# Altium schematic sheet Skayboard.SchDoc: Skayboard
size 762 x 304 mm; ApprovedBy: NNNI; CheckedBy: NNNI; Author: Skaytacium; CompanyName: Skaytacium Inc.; DrawnBy: Skaytacium; Engineer: SSSI; Organization: Skaytacium Inc.; Revision: 6
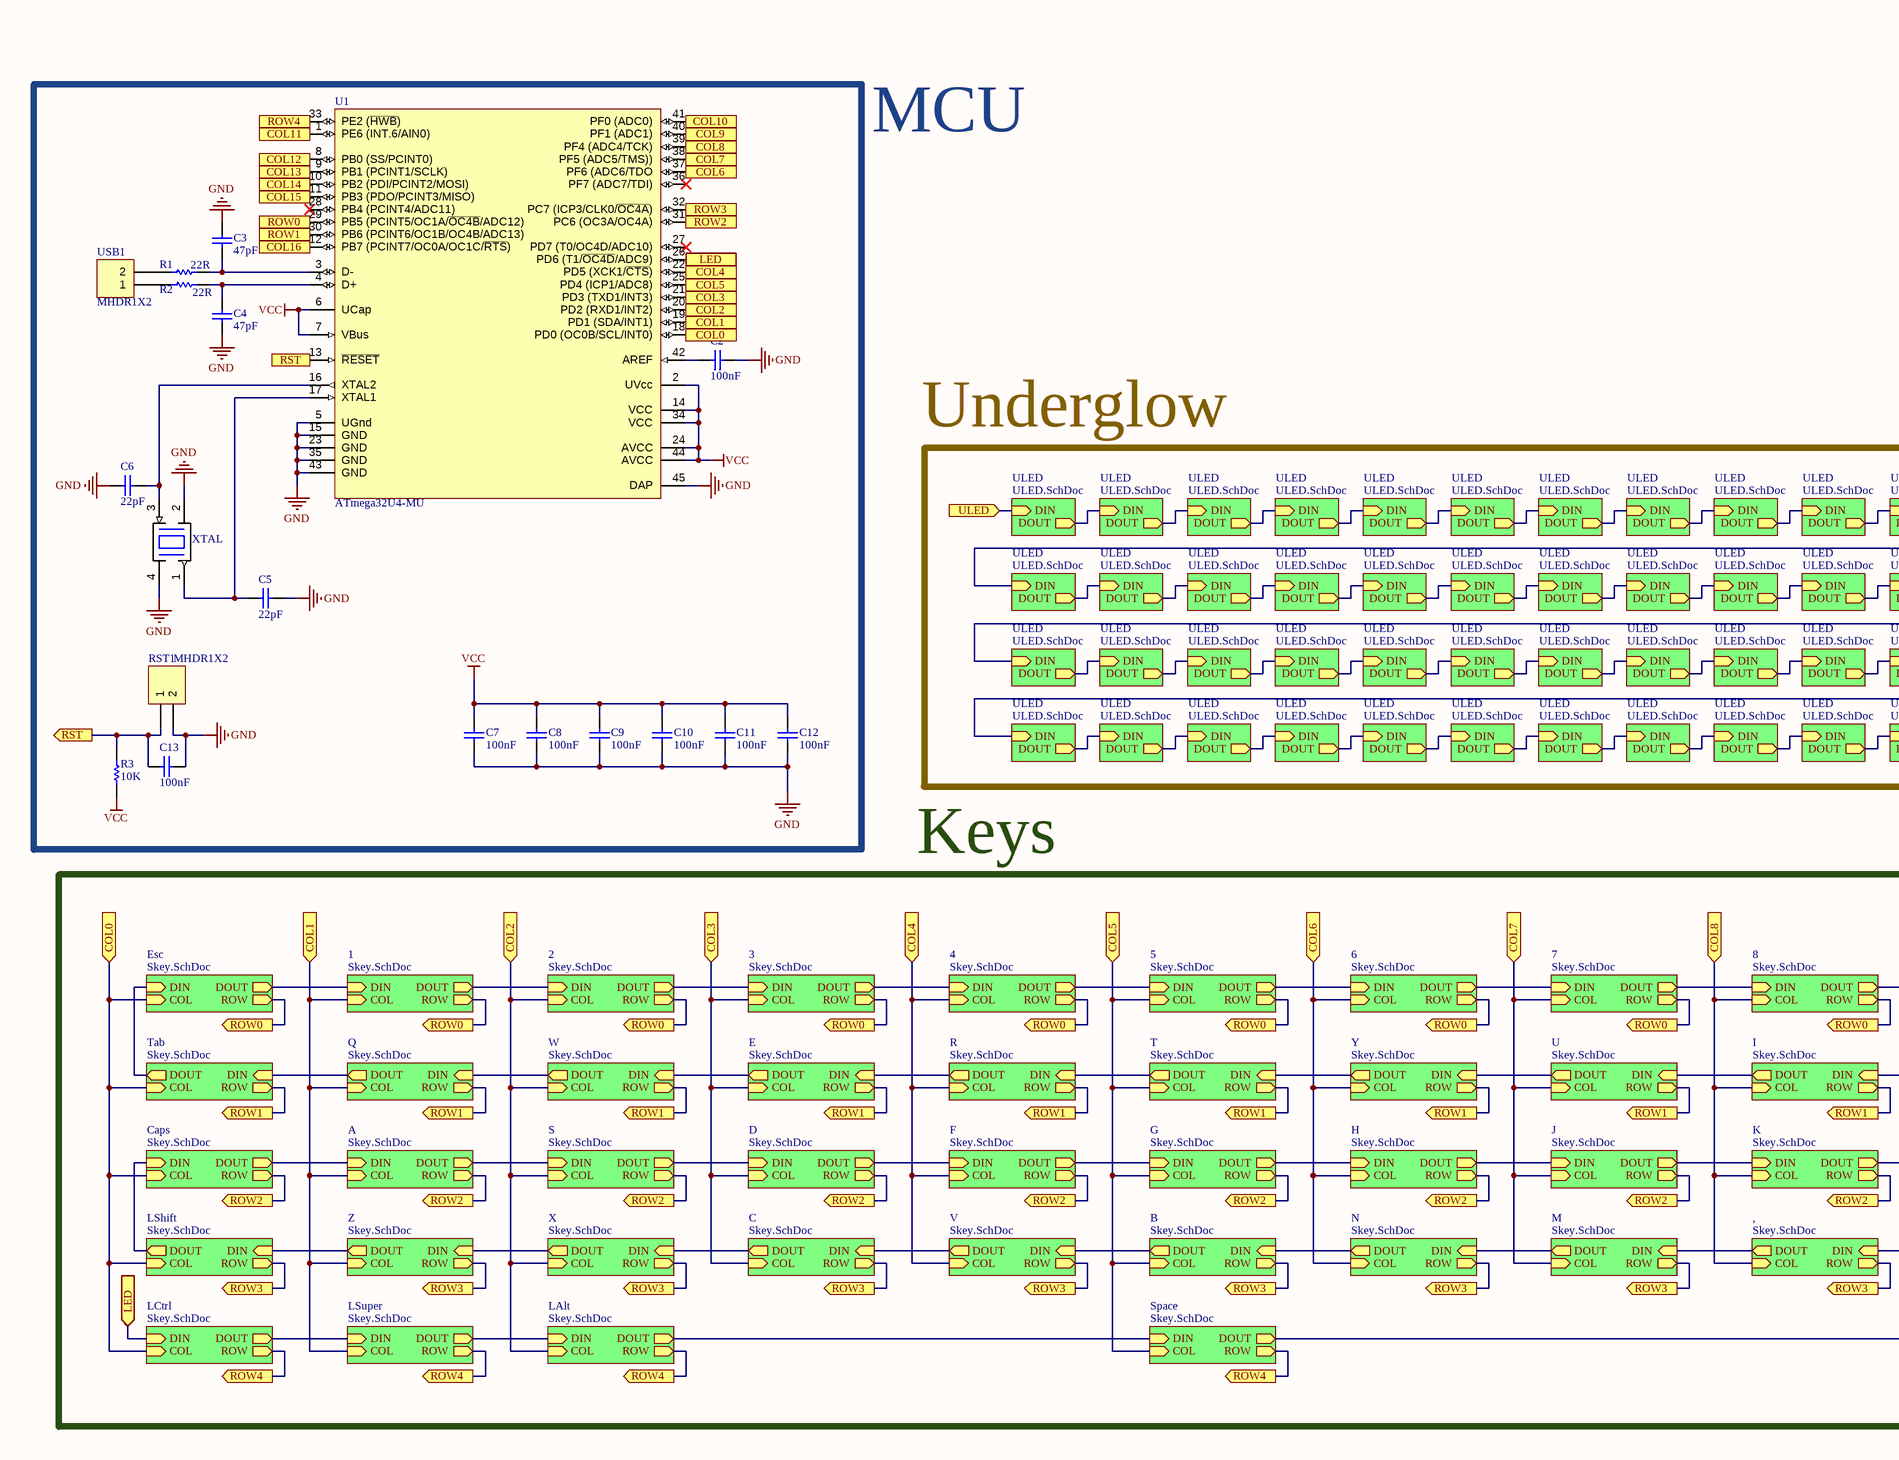
[diagram p0: Skayboard.SchDoc, left]
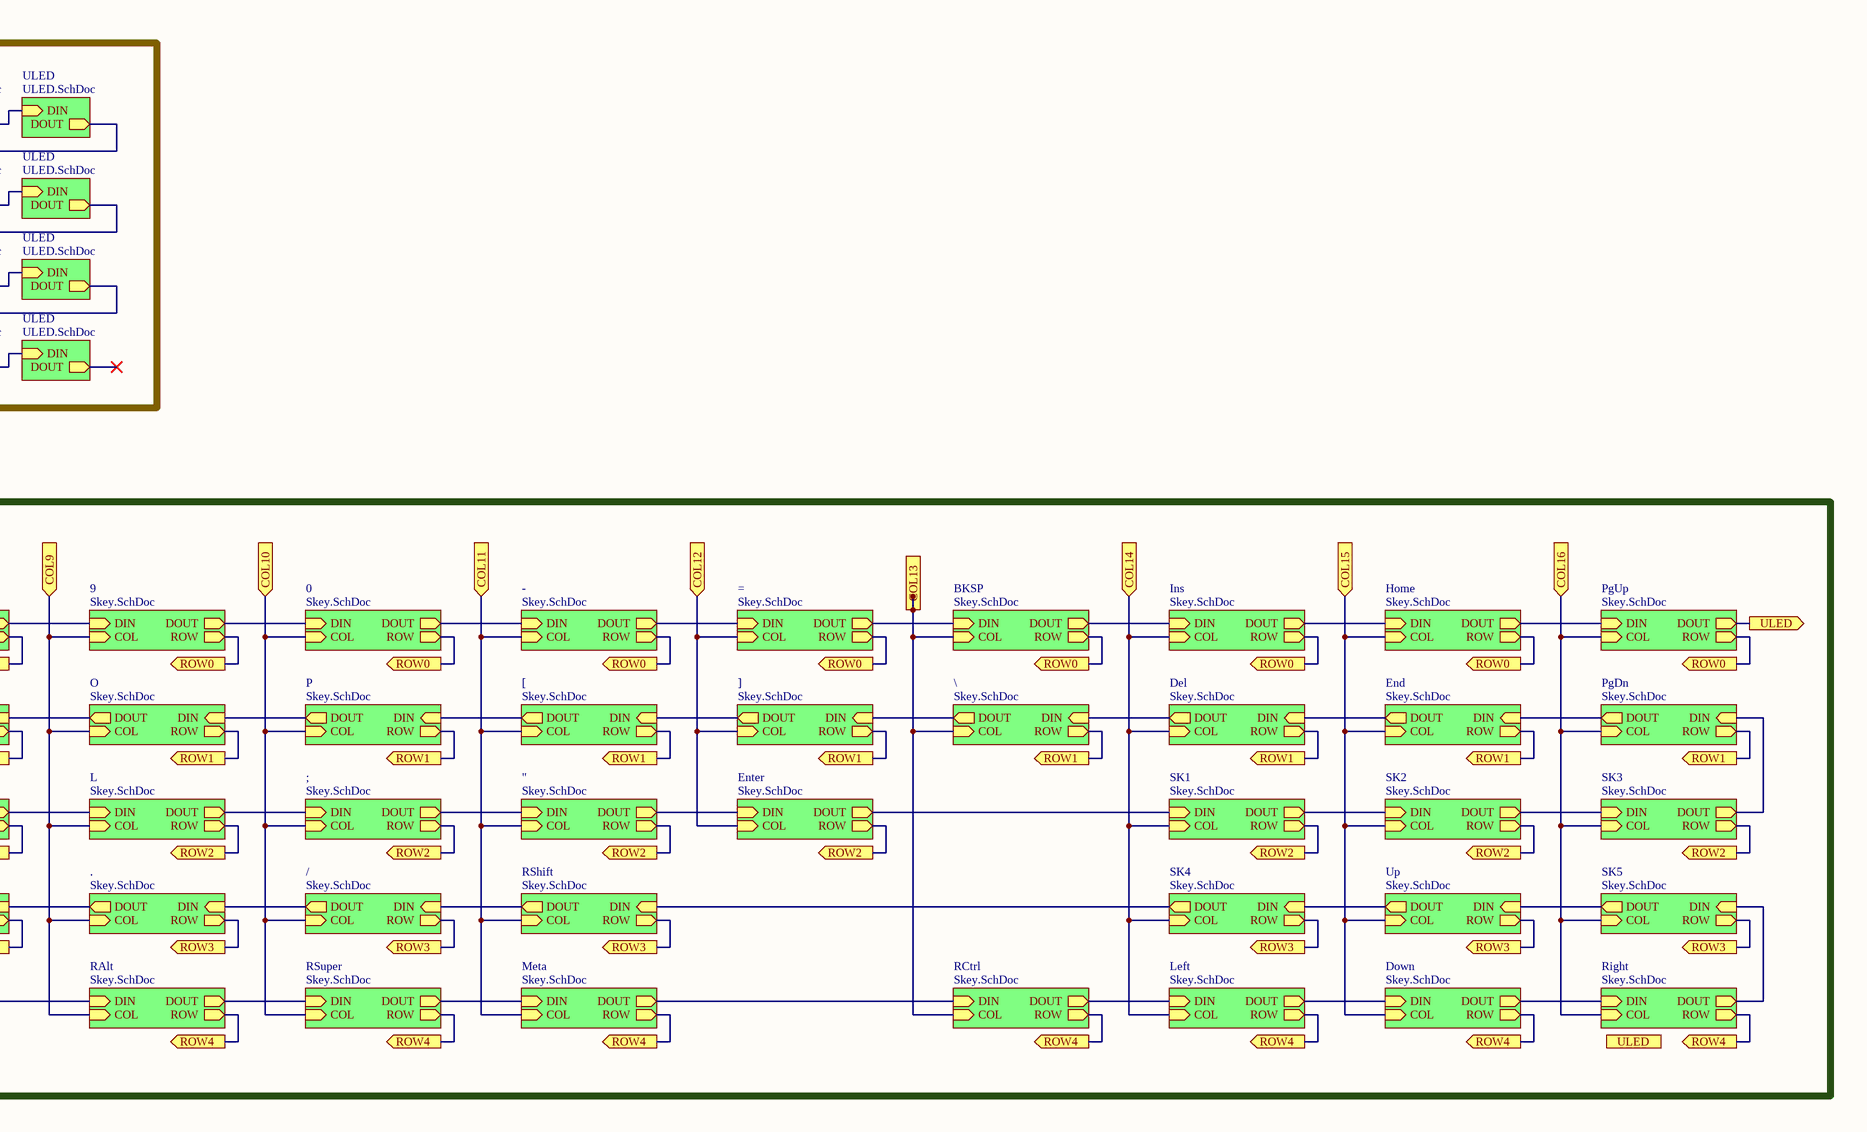
[diagram p1: Skayboard.SchDoc, right]

## Parts
C2  100nF  [CAPC1005X55X30LL05T10]
C3  47pF  [CAPC1005X55X25LL05T10]
C4  47pF  [CAPC1005X55X25LL05T10]
C5  22pF  [CAPC1005X56X25NL10T15]
C6  22pF  [CAPC1005X56X25NL10T15]
C7  100nF  [CAPC1005X55X30LL05T10]
C8  100nF  [CAPC1005X55X30LL05T10]
C9  100nF  [CAPC1005X55X30LL05T10]
C10  100nF  [CAPC1005X55X30LL05T10]
C11  100nF  [CAPC1005X55X30LL05T10]
C12  100nF  [CAPC1005X55X30LL05T10]
C13  100nF  [CAPC1005X55X30LL05T10]
R1  22R  [RESC1005X40X25LL05T05]
R2  22R  [RESC1005X40X25LL05T05]
R3  10K  [RESC1005X40X25NL05T05]
RST1  MHDR1X2  [MHDR1X2]
U1  ATmega32U4-MU  [44PW_M]
USB1  MHDR1X2  [MHDR1X2]
XTAL  16MCR  [XTAL16M]  (value not drawn)

## Sub-sheets
0 = Skey.SchDoc: ROW (out), COL (in), DIN (in), DOUT (out)
1 = Skey.SchDoc: ROW (out), COL (in), DIN (in), DOUT (out)
2 = Skey.SchDoc: ROW (out), COL (in), DIN (in), DOUT (out)
3 = Skey.SchDoc: ROW (out), COL (in), DIN (in), DOUT (out)
4 = Skey.SchDoc: ROW (out), COL (in), DIN (in), DOUT (out)
5 = Skey.SchDoc: ROW (out), COL (in), DIN (in), DOUT (out)
6 = Skey.SchDoc: ROW (out), COL (in), DIN (in), DOUT (out)
7 = Skey.SchDoc: ROW (out), COL (in), DIN (in), DOUT (out)
8 = Skey.SchDoc: ROW (out), COL (in), DIN (in), DOUT (out)
9 = Skey.SchDoc: ROW (out), COL (in), DIN (in), DOUT (out)
" = Skey.SchDoc: ROW (out), COL (in), DIN (in), DOUT (out)
, = Skey.SchDoc: ROW (out), COL (in), DIN (in), DOUT (out)
- = Skey.SchDoc: ROW (out), COL (in), DIN (in), DOUT (out)
. = Skey.SchDoc: ROW (out), COL (in), DIN (in), DOUT (out)
/ = Skey.SchDoc: ROW (out), COL (in), DIN (in), DOUT (out)
; = Skey.SchDoc: ROW (out), COL (in), DIN (in), DOUT (out)
= = Skey.SchDoc: ROW (out), COL (in), DIN (in), DOUT (out)
[ = Skey.SchDoc: ROW (out), COL (in), DIN (in), DOUT (out)
\ = Skey.SchDoc: ROW (out), COL (in), DIN (in), DOUT (out)
] = Skey.SchDoc: ROW (out), COL (in), DIN (in), DOUT (out)
A = Skey.SchDoc: ROW (out), COL (in), DIN (in), DOUT (out)
B = Skey.SchDoc: ROW (out), COL (in), DIN (in), DOUT (out)
BKSP = Skey.SchDoc: ROW (out), COL (in), DIN (in), DOUT (out)
C = Skey.SchDoc: ROW (out), COL (in), DIN (in), DOUT (out)
Caps = Skey.SchDoc: ROW (out), COL (in), DIN (in), DOUT (out)
D = Skey.SchDoc: ROW (out), COL (in), DIN (in), DOUT (out)
Del = Skey.SchDoc: ROW (out), COL (in), DIN (in), DOUT (out)
Down = Skey.SchDoc: ROW (out), COL (in), DIN (in), DOUT (out)
E = Skey.SchDoc: ROW (out), COL (in), DIN (in), DOUT (out)
End = Skey.SchDoc: ROW (out), COL (in), DIN (in), DOUT (out)
Enter = Skey.SchDoc: ROW (out), COL (in), DIN (in), DOUT (out)
Esc = Skey.SchDoc: ROW (out), COL (in), DIN (in), DOUT (out)
F = Skey.SchDoc: ROW (out), COL (in), DIN (in), DOUT (out)
G = Skey.SchDoc: ROW (out), COL (in), DIN (in), DOUT (out)
H = Skey.SchDoc: ROW (out), COL (in), DIN (in), DOUT (out)
Home = Skey.SchDoc: ROW (out), COL (in), DIN (in), DOUT (out)
I = Skey.SchDoc: ROW (out), COL (in), DIN (in), DOUT (out)
Ins = Skey.SchDoc: ROW (out), COL (in), DIN (in), DOUT (out)
J = Skey.SchDoc: ROW (out), COL (in), DIN (in), DOUT (out)
K = Skey.SchDoc: ROW (out), COL (in), DIN (in), DOUT (out)
L = Skey.SchDoc: ROW (out), COL (in), DIN (in), DOUT (out)
LAlt = Skey.SchDoc: ROW (out), COL (in), DIN (in), DOUT (out)
LCtrl = Skey.SchDoc: ROW (out), COL (in), DIN (in), DOUT (out)
Left = Skey.SchDoc: ROW (out), COL (in), DIN (in), DOUT (out)
LShift = Skey.SchDoc: ROW (out), COL (in), DIN (in), DOUT (out)
LSuper = Skey.SchDoc: ROW (out), COL (in), DIN (in), DOUT (out)
M = Skey.SchDoc: ROW (out), COL (in), DIN (in), DOUT (out)
Meta = Skey.SchDoc: ROW (out), COL (in), DIN (in), DOUT (out)
N = Skey.SchDoc: ROW (out), COL (in), DIN (in), DOUT (out)
O = Skey.SchDoc: ROW (out), COL (in), DIN (in), DOUT (out)
P = Skey.SchDoc: ROW (out), COL (in), DIN (in), DOUT (out)
PgDn = Skey.SchDoc: ROW (out), COL (in), DIN (in), DOUT (out)
PgUp = Skey.SchDoc: ROW (out), COL (in), DIN (in), DOUT (out)
Q = Skey.SchDoc: ROW (out), COL (in), DIN (in), DOUT (out)
R = Skey.SchDoc: ROW (out), COL (in), DIN (in), DOUT (out)
RAlt = Skey.SchDoc: ROW (out), COL (in), DIN (in), DOUT (out)
RCtrl = Skey.SchDoc: ROW (out), COL (in), DIN (in), DOUT (out)
Right = Skey.SchDoc: ROW (out), COL (in), DIN (in), DOUT (out)
RShift = Skey.SchDoc: ROW (out), COL (in), DIN (in), DOUT (out)
RSuper = Skey.SchDoc: ROW (out), COL (in), DIN (in), DOUT (out)
S = Skey.SchDoc: ROW (out), COL (in), DIN (in), DOUT (out)
SK1 = Skey.SchDoc: ROW (out), COL (in), DIN (in), DOUT (out)
SK2 = Skey.SchDoc: ROW (out), COL (in), DIN (in), DOUT (out)
SK3 = Skey.SchDoc: ROW (out), COL (in), DIN (in), DOUT (out)
SK4 = Skey.SchDoc: ROW (out), COL (in), DIN (in), DOUT (out)
SK5 = Skey.SchDoc: ROW (out), COL (in), DIN (in), DOUT (out)
Space = Skey.SchDoc: ROW (out), COL (in), DIN (in), DOUT (out)
T = Skey.SchDoc: ROW (out), COL (in), DIN (in), DOUT (out)
Tab = Skey.SchDoc: ROW (out), COL (in), DIN (in), DOUT (out)
U = Skey.SchDoc: ROW (out), COL (in), DIN (in), DOUT (out)
ULED = ULED.SchDoc: DOUT (out), DIN (in)
ULED = ULED.SchDoc: DOUT (out), DIN (in)
ULED = ULED.SchDoc: DOUT (out), DIN (in)
ULED = ULED.SchDoc: DOUT (out), DIN (in)
ULED = ULED.SchDoc: DOUT (out), DIN (in)
ULED = ULED.SchDoc: DOUT (out), DIN (in)
ULED = ULED.SchDoc: DOUT (out), DIN (in)
ULED = ULED.SchDoc: DOUT (out), DIN (in)
ULED = ULED.SchDoc: DOUT (out), DIN (in)
ULED = ULED.SchDoc: DOUT (out), DIN (in)
ULED = ULED.SchDoc: DOUT (out), DIN (in)
ULED = ULED.SchDoc: DOUT (out), DIN (in)
ULED = ULED.SchDoc: DOUT (out), DIN (in)
ULED = ULED.SchDoc: DOUT (out), DIN (in)
ULED = ULED.SchDoc: DOUT (out), DIN (in)
ULED = ULED.SchDoc: DOUT (out), DIN (in)
ULED = ULED.SchDoc: DOUT (out), DIN (in)
ULED = ULED.SchDoc: DOUT (out), DIN (in)
ULED = ULED.SchDoc: DOUT (out), DIN (in)
ULED = ULED.SchDoc: DOUT (out), DIN (in)
ULED = ULED.SchDoc: DOUT (out), DIN (in)
ULED = ULED.SchDoc: DOUT (out), DIN (in)
ULED = ULED.SchDoc: DOUT (out), DIN (in)
ULED = ULED.SchDoc: DOUT (out), DIN (in)
ULED = ULED.SchDoc: DOUT (out), DIN (in)
ULED = ULED.SchDoc: DOUT (out), DIN (in)
ULED = ULED.SchDoc: DOUT (out), DIN (in)
ULED = ULED.SchDoc: DOUT (out), DIN (in)
ULED = ULED.SchDoc: DOUT (out), DIN (in)
ULED = ULED.SchDoc: DOUT (out), DIN (in)
ULED = ULED.SchDoc: DOUT (out), DIN (in)
ULED = ULED.SchDoc: DOUT (out), DIN (in)
ULED = ULED.SchDoc: DOUT (out), DIN (in)
ULED = ULED.SchDoc: DOUT (out), DIN (in)
ULED = ULED.SchDoc: DOUT (out), DIN (in)
ULED = ULED.SchDoc: DOUT (out), DIN (in)
ULED = ULED.SchDoc: DOUT (out), DIN (in)
ULED = ULED.SchDoc: DOUT (out), DIN (in)
ULED = ULED.SchDoc: DOUT (out), DIN (in)
ULED = ULED.SchDoc: DOUT (out), DIN (in)
ULED = ULED.SchDoc: DOUT (out), DIN (in)
ULED = ULED.SchDoc: DOUT (out), DIN (in)
ULED = ULED.SchDoc: DOUT (out), DIN (in)
ULED = ULED.SchDoc: DOUT (out), DIN (in)
Up = Skey.SchDoc: ROW (out), COL (in), DIN (in), DOUT (out)
V = Skey.SchDoc: ROW (out), COL (in), DIN (in), DOUT (out)
W = Skey.SchDoc: ROW (out), COL (in), DIN (in), DOUT (out)
X = Skey.SchDoc: ROW (out), COL (in), DIN (in), DOUT (out)
Y = Skey.SchDoc: ROW (out), COL (in), DIN (in), DOUT (out)
Z = Skey.SchDoc: ROW (out), COL (in), DIN (in), DOUT (out)

## Ports
COL0 (in), COL0 (out), COL1 (in), COL1 (out), COL2 (in), COL2 (out), COL3 (in), COL3 (out), COL4 (in), COL4 (out), COL5 (in), COL5 (out), COL6 (in), COL6 (out), COL7 (in), COL7 (out), COL8 (in), COL8 (out), COL9 (in), COL9 (out), COL10 (in), COL10 (out), COL11 (in), COL11 (out), COL12 (in), COL12 (out), COL13 (in), COL13 (out), COL14 (in), COL14 (out), COL15 (in), COL15 (out), COL16 (in), COL16 (out), LED (in), LED (out), ROW0 (in), ROW0 (out), ROW1 (in), ROW1 (out), ROW2 (in), ROW2 (out), ROW3 (in), ROW3 (out), ROW4 (in), ROW4 (out), RST (in), RST (out), ULED (in), ULED (out)

## Nets
GND: C2.2 C3.2 C4.1 C5.1 C6.1 C7.1 C8.1 C9.1 C10.1 C11.1 C12.1 C13.1 RST1.2 U1.5(UGnd) U1.15(GND) U1.23(GND) U1.35(GND) U1.43(GND) U1.45(DAP) XTAL.2 XTAL.4
VCC: C7.2 C8.2 C9.2 C10.2 C11.2 C12.2 R3.1 U1.2(UVcc) U1.6(UCap) U1.7(VBus) U1.14(VCC) U1.24(AVCC) U1.34(VCC) U1.44(AVCC)
COL0: U1.18(PD0_(OC0B/SCL/INT0)) ; port COL0, sheet Esc/COL, sheet Tab/COL, sheet Caps/COL, sheet LShift/COL, sheet LCtrl/COL
COL1: U1.19(PD1_(SDA/INT1)) ; port COL1, sheet 1/COL, sheet Q/COL, sheet A/COL, sheet Z/COL, sheet LSuper/COL
COL2: U1.20(PD2_(RXD1/INT2)) ; port COL2, sheet 2/COL, sheet W/COL, sheet S/COL, sheet X/COL, sheet LAlt/COL
COL3: U1.21(PD3_(TXD1/INT3)) ; port COL3, sheet 3/COL, sheet E/COL, sheet D/COL, sheet C/COL
COL4: U1.22(PD5_(XCK1/~{CTS})) ; port COL4, sheet 4/COL, sheet R/COL, sheet F/COL, sheet V/COL
COL5: U1.25(PD4_(ICP1/ADC8)) ; port COL5, sheet 5/COL, sheet T/COL, sheet G/COL, sheet B/COL, sheet Space/COL
COL6: U1.37(PF6_(ADC6/TDO) ; port COL6, sheet 6/COL, sheet Y/COL, sheet H/COL, sheet N/COL
COL7: U1.38(PF5_(ADC5/TMS))) ; port COL7, sheet 7/COL, sheet U/COL, sheet J/COL, sheet M/COL
COL8: U1.39(PF4_(ADC4/TCK)) ; port COL8, sheet 8/COL, sheet I/COL, sheet K/COL, sheet ,/COL
COL9: U1.40(PF1_(ADC1)) ; port COL9, sheet 9/COL, sheet O/COL, sheet L/COL, sheet ./COL, sheet RAlt/COL
COL10: U1.41(PF0_(ADC0)) ; port COL10, sheet 0/COL, sheet P/COL, sheet ;/COL, sheet //COL, sheet RSuper/COL
COL11: U1.1(PE6_(INT.6/AIN0)) ; port COL11, sheet -/COL, sheet [/COL, sheet "/COL, sheet RShift/COL, sheet Meta/COL
COL12: U1.8(PB0_(SS/PCINT0)) ; port COL12, sheet =/COL, sheet ]/COL, sheet Enter/COL
COL13: U1.9(PB1_(PCINT1/SCLK)) ; port COL13, sheet BKSP/COL, sheet \/COL, sheet RCtrl/COL
COL14: U1.10(PB2_(PDI/PCINT2/MOSI)) ; port COL14, sheet Ins/COL, sheet Del/COL, sheet SK1/COL, sheet SK4/COL, sheet Left/COL
COL15: U1.11(PB3_(PDO/PCINT3/MISO)) ; port COL15, sheet Home/COL, sheet End/COL, sheet SK2/COL, sheet Up/COL, sheet Down/COL
COL16: U1.12(PB7_(PCINT7/OC0A/OC1C/~{RTS})) ; port COL16, sheet PgUp/COL, sheet PgDn/COL, sheet SK3/COL, sheet SK5/COL, sheet Right/COL
LED: U1.26(PD6_(T1/~{OC4D}/ADC9)) ; port LED, sheet LCtrl/DIN
ROW0: U1.29(PB5_(PCINT5/OC1A/~{OC4B}/ADC12)) ; port ROW0, sheet Esc/ROW, sheet 1/ROW, sheet 2/ROW, sheet 3/ROW, sheet 4/ROW, sheet 5/ROW, sheet 6/ROW, sheet 7/ROW, sheet 8/ROW, sheet 9/ROW, sheet 0/ROW, sheet -/ROW, sheet =/ROW, sheet BKSP/ROW, sheet Ins/ROW, sheet Home/ROW, sheet PgUp/ROW
ROW1: U1.30(PB6_(PCINT6/OC1B/OC4B/ADC13)) ; port ROW1, sheet Q/ROW, sheet W/ROW, sheet E/ROW, sheet R/ROW, sheet T/ROW, sheet Y/ROW, sheet U/ROW, sheet I/ROW, sheet O/ROW, sheet P/ROW, sheet [/ROW, sheet ]/ROW, sheet \/ROW, sheet Del/ROW, sheet End/ROW, sheet PgDn/ROW, sheet Tab/ROW
ROW2: U1.31(PC6_(OC3A/OC4A)) ; port ROW2, sheet A/ROW, sheet S/ROW, sheet D/ROW, sheet F/ROW, sheet G/ROW, sheet H/ROW, sheet J/ROW, sheet K/ROW, sheet L/ROW, sheet ;/ROW, sheet "/ROW, sheet Enter/ROW, sheet SK1/ROW, sheet SK2/ROW, sheet SK3/ROW, sheet Caps/ROW
ROW3: U1.32(PC7_(ICP3/CLK0/~{OC4A})) ; port ROW3, sheet Z/ROW, sheet X/ROW, sheet C/ROW, sheet V/ROW, sheet B/ROW, sheet N/ROW, sheet M/ROW, sheet ,/ROW, sheet ./ROW, sheet //ROW, sheet RShift/ROW, sheet SK4/ROW, sheet Up/ROW, sheet SK5/ROW, sheet LShift/ROW
ROW4: U1.33(PE2_(~{HWB})) ; port ROW4, sheet RCtrl/ROW, sheet LSuper/ROW, sheet LAlt/ROW, sheet Space/ROW, sheet RAlt/ROW, sheet RSuper/ROW, sheet Meta/ROW, sheet Left/ROW, sheet Down/ROW, sheet Right/ROW, sheet LCtrl/ROW
RST: C13.2 R3.2 RST1.1 U1.13(~{RESET}) ; port RST
ULED: port ULED, sheet ULED/DIN, sheet PgUp/DOUT
NetC2_1: C2.1 U1.42(AREF)
NetC3_1: C3.1 R1.1 U1.3(D-)
NetC4_2: C4.2 R2.1 U1.4(D+)
NetC5_2: C5.2 U1.17(XTAL1) XTAL.1
NetC6_2: C6.2 U1.16(XTAL2) XTAL.3
NetR1_2: R1.2 USB1.2
NetR2_2: R2.2 USB1.1
(unnamed): sheet ULED/DOUT, sheet ULED/DIN
(unnamed): sheet ULED/DOUT, sheet ULED/DIN
(unnamed): sheet ULED/DOUT, sheet ULED/DIN
(unnamed): sheet ULED/DOUT, sheet ULED/DIN
(unnamed): sheet ULED/DOUT, sheet ULED/DIN
(unnamed): sheet ULED/DOUT, sheet ULED/DIN
(unnamed): sheet ULED/DOUT, sheet ULED/DIN
(unnamed): sheet ULED/DOUT, sheet ULED/DIN
(unnamed): sheet ULED/DOUT, sheet ULED/DIN
(unnamed): sheet ULED/DOUT, sheet ULED/DIN
(unnamed): sheet ULED/DOUT, sheet ULED/DIN
(unnamed): sheet ULED/DOUT, sheet ULED/DIN
(unnamed): sheet ULED/DOUT, sheet ULED/DIN
(unnamed): sheet ULED/DOUT, sheet ULED/DIN
(unnamed): sheet ULED/DOUT, sheet ULED/DIN
(unnamed): sheet ULED/DOUT, sheet ULED/DIN
(unnamed): sheet ULED/DOUT, sheet ULED/DIN
(unnamed): sheet ULED/DOUT, sheet ULED/DIN
(unnamed): sheet ULED/DOUT, sheet ULED/DIN
(unnamed): sheet ULED/DOUT, sheet ULED/DIN
(unnamed): sheet ULED/DOUT, sheet ULED/DIN
(unnamed): sheet ULED/DOUT, sheet ULED/DIN
(unnamed): sheet ULED/DOUT, sheet ULED/DIN
(unnamed): sheet ULED/DOUT, sheet ULED/DIN
(unnamed): sheet ULED/DOUT, sheet ULED/DIN
(unnamed): sheet ULED/DOUT, sheet ULED/DIN
(unnamed): sheet ULED/DOUT, sheet ULED/DIN
(unnamed): sheet ULED/DOUT, sheet ULED/DIN
(unnamed): sheet ULED/DOUT, sheet ULED/DIN
(unnamed): sheet ULED/DOUT, sheet ULED/DIN
(unnamed): sheet ULED/DOUT, sheet ULED/DIN
(unnamed): sheet ULED/DOUT, sheet ULED/DIN
(unnamed): sheet ULED/DOUT, sheet ULED/DIN
(unnamed): sheet ULED/DOUT, sheet ULED/DIN
(unnamed): sheet ULED/DOUT, sheet ULED/DIN
(unnamed): sheet ULED/DOUT, sheet ULED/DIN
(unnamed): sheet ULED/DOUT, sheet ULED/DIN
(unnamed): sheet ULED/DOUT, sheet ULED/DIN
(unnamed): sheet ULED/DOUT, sheet ULED/DIN
(unnamed): sheet ULED/DOUT, sheet ULED/DIN
(unnamed): sheet ULED/DOUT, sheet ULED/DIN
(unnamed): sheet ULED/DOUT, sheet ULED/DIN
(unnamed): sheet ULED/DOUT, sheet ULED/DIN
(unnamed): sheet Esc/DIN, sheet Tab/DOUT
(unnamed): sheet Esc/DOUT, sheet 1/DIN
(unnamed): sheet 1/DOUT, sheet 2/DIN
(unnamed): sheet 2/DOUT, sheet 3/DIN
(unnamed): sheet 3/DOUT, sheet 4/DIN
(unnamed): sheet 4/DOUT, sheet 5/DIN
(unnamed): sheet 5/DOUT, sheet 6/DIN
(unnamed): sheet 6/DOUT, sheet 7/DIN
(unnamed): sheet 7/DOUT, sheet 8/DIN
(unnamed): sheet 8/DOUT, sheet 9/DIN
(unnamed): sheet 9/DOUT, sheet 0/DIN
(unnamed): sheet 0/DOUT, sheet -/DIN
(unnamed): sheet -/DOUT, sheet =/DIN
(unnamed): sheet =/DOUT, sheet BKSP/DIN
(unnamed): sheet BKSP/DOUT, sheet Ins/DIN
(unnamed): sheet Ins/DOUT, sheet Home/DIN
(unnamed): sheet Home/DOUT, sheet PgUp/DIN
(unnamed): sheet Q/DIN, sheet W/DOUT
(unnamed): sheet Q/DOUT, sheet Tab/DIN
(unnamed): sheet W/DIN, sheet E/DOUT
(unnamed): sheet E/DIN, sheet R/DOUT
(unnamed): sheet R/DIN, sheet T/DOUT
(unnamed): sheet T/DIN, sheet Y/DOUT
(unnamed): sheet Y/DIN, sheet U/DOUT
(unnamed): sheet U/DIN, sheet I/DOUT
(unnamed): sheet I/DIN, sheet O/DOUT
(unnamed): sheet O/DIN, sheet P/DOUT
(unnamed): sheet P/DIN, sheet [/DOUT
(unnamed): sheet [/DIN, sheet ]/DOUT
(unnamed): sheet ]/DIN, sheet \/DOUT
(unnamed): sheet \/DIN, sheet Del/DOUT
(unnamed): sheet Del/DIN, sheet End/DOUT
(unnamed): sheet End/DIN, sheet PgDn/DOUT
(unnamed): sheet PgDn/DIN, sheet SK3/DOUT
(unnamed): sheet A/DIN, sheet Caps/DOUT
(unnamed): sheet A/DOUT, sheet S/DIN
(unnamed): sheet S/DOUT, sheet D/DIN
(unnamed): sheet D/DOUT, sheet F/DIN
(unnamed): sheet F/DOUT, sheet G/DIN
(unnamed): sheet G/DOUT, sheet H/DIN
(unnamed): sheet H/DOUT, sheet J/DIN
(unnamed): sheet J/DOUT, sheet K/DIN
(unnamed): sheet K/DOUT, sheet L/DIN
(unnamed): sheet L/DOUT, sheet ;/DIN
(unnamed): sheet ;/DOUT, sheet "/DIN
(unnamed): sheet "/DOUT, sheet Enter/DIN
(unnamed): sheet Enter/DOUT, sheet SK1/DIN
(unnamed): sheet RCtrl/DIN, sheet Meta/DOUT
(unnamed): sheet RCtrl/DOUT, sheet Left/DIN
(unnamed): sheet SK1/DOUT, sheet SK2/DIN
(unnamed): sheet SK2/DOUT, sheet SK3/DIN
(unnamed): sheet Z/DIN, sheet X/DOUT
(unnamed): sheet Z/DOUT, sheet LShift/DIN
(unnamed): sheet X/DIN, sheet C/DOUT
(unnamed): sheet C/DIN, sheet V/DOUT
(unnamed): sheet V/DIN, sheet B/DOUT
(unnamed): sheet B/DIN, sheet N/DOUT
(unnamed): sheet N/DIN, sheet M/DOUT
(unnamed): sheet M/DIN, sheet ,/DOUT
(unnamed): sheet ,/DIN, sheet ./DOUT
(unnamed): sheet ./DIN, sheet //DOUT
(unnamed): sheet //DIN, sheet RShift/DOUT
(unnamed): sheet RShift/DIN, sheet SK4/DOUT
(unnamed): sheet SK4/DIN, sheet Up/DOUT
(unnamed): sheet Up/DIN, sheet SK5/DOUT
(unnamed): sheet SK5/DIN, sheet Right/DOUT
(unnamed): sheet LSuper/DIN, sheet LCtrl/DOUT
(unnamed): sheet LSuper/DOUT, sheet LAlt/DIN
(unnamed): sheet LAlt/DOUT, sheet Space/DIN
(unnamed): sheet Space/DOUT, sheet RAlt/DIN
(unnamed): sheet RAlt/DOUT, sheet RSuper/DIN
(unnamed): sheet RSuper/DOUT, sheet Meta/DIN
(unnamed): sheet Left/DOUT, sheet Down/DIN
(unnamed): sheet Down/DOUT, sheet Right/DIN
(unnamed): sheet Caps/DIN, sheet LShift/DOUT

Not connected (* = marked no-connect by the designer): U1 27(PD7_(T0/OC4D/ADC10))* 28(PB4_(PCINT4/ADC11))* 36(PF7_(ADC7/TDI))*

## Notes on the sheet
- MCU
- Underglow
- Keys
- DWG. NO.
- REV.
- SHT.
- THIS DOCUMENT AND THE DATA DISCLOSED HEREIN OR HEREWITH IS THE PROPERTY OF ALTIUM LIMITED AND MAY BE FREELY DISTRIBUTED IN WHOLE. NO RIGHTS ARE RESERVED OR EXPRESS OR IMPLIED WARANTEE GIVEN.
- REVISION
- DESCRIPTION
- DATE
- APPROVED
- ENG:
- APPROVALS
- PROJECT
- DSN:
- CHK:
- REFERENCE DOCUMENTS
- PROJECT REVISION:
- TITLE
- DOCUMENT REVISION:
- DESIGN ITEM:
- BOM:
- FAB DWG:
- PCB DWG:
- ASSY DWG:
- SCALE:
- SIZE
- B
- CAGE CODE
- FILE NAME
- DWG NO.
- SHEET
- OF
- REV

## Library data of the parts
C2 C7-C13 = CMP-0001-00074-2: Manufacturer: Kemet; Part Number: C0402C104K4RACTU
C3 C4 = CMP-2008-04368-1: Part Number: GRM1555C1H470JA01D; Manufacturer: Murata
C5 C6 = CMP-2008-02613-1: Part Number: 04025A220JAT2A; Manufacturer: AVX Interconnect / Elco
R1 R2 = CMP-2002-08382-1: 22; Manufacturer: Vishay Dale; Part Number: CRCW040222R0FKED
R3 = CMP-2002-01183-1: Part Number: ERT-J0ER103J; Manufacturer: Panasonic
RST1 USB1 = MHDR1X2: Header, 2-Pin; LatestRevisionDate: 17-Jul-2002; LatestRevisionNote: Re-released for DXP Platform.; Publisher: Altium Limited
U1 = CMP-0095-00166-2: 8-bit AVR Microcontroller, 2.7-5.5V, 16MHz, 32KB Flash, 1KB EEPROM, 2.5KB SRAM, USB Controller, 44-pin QFN, Industrial Grade (-40°C to 85°C), Ext Osc; PackageVersion: revG, Sep-2009; PackageReference: 44PW; ComponentLink1URL: http://www.atmel.com/; PackageDescription: 44-Pin Quad Flat No-Lead Package, 7 x 7 mm Body, 0.5 mm Pitch (QFN); ComponentLink3Description: ATmega16U4 ATmega32U4 Summary; RevisionNote: DatasheetVersion, PackageVersion & PCB updated. URLs added.; ComponentLink2Description: ATmega16U4/32U4 Datasheet; ComponentLink1Description: Manufacturer URL; ComponentLink3URL: http://www.atmel.com/dyn/resources/prod_documents/7766S.pdf; DatasheetVersion: revF, Nov-2010; ComponentLink2URL: http://www.atmel.com/dyn/resources/prod_documents/doc7766.pdf; Code_JEDEC: MO-220-VKKD-1
XTAL = 16MCR: 16Mhz crystal resonator, JLCPCB #C13738